# EAGLE design plugthroughckt (EAGLE 6.2)
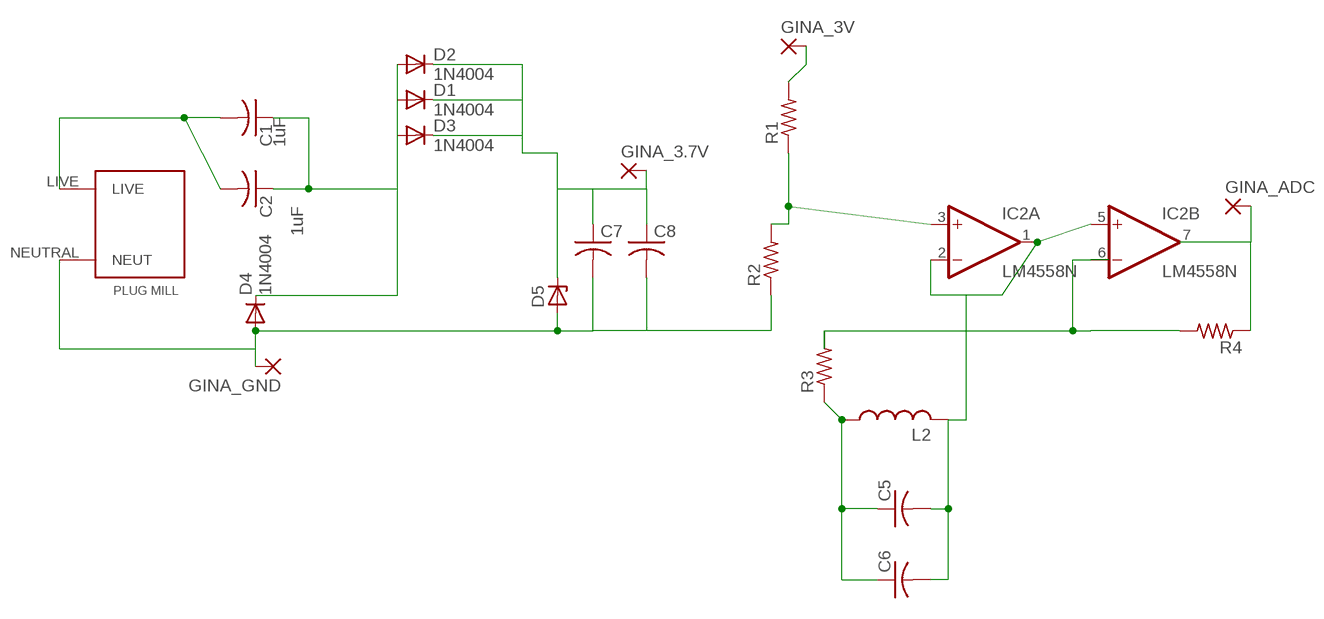
[diagram p0: schematic, sheet 1]

## Parts
C1  C-US075-032X103  [C075-032X103]
C2  C-US075-032X103  [C075-032X103]
C5  C-US075-032X103  [C075-032X103]
C6  C-US075-032X103  [C075-032X103]
C7  C-US025-050X050  [C025-050X050]
C8  C-US025-050X050  [C025-050X050]
D1  1N4004  [DO41-10]
D2  1N4004  [DO41-10]
D3  1N4004  [DO41-10]
D4  1N4004  [DO41-10]
D5  ZENER-DIODEDO41Z10  [DO41Z10]
GINA_3.7V  3,81/1,4  [3,81/1,4]
GINA_3V  3,81/1,4  [3,81/1,4]
GINA_ADC  3,81/1,4  [3,81/1,4]
GINA_GND  3,81/1,4  [3,81/1,4]
IC2  LM4558N  [DIL08]
L2  L-US0207/5V  [0207/5V]
R1  R-US_0207/10  [0207/10]
R2  R-US_0207/10  [0207/10]
R3  R-US_0207/10  [0207/10]
R4  R-US_0207/10  [0207/10]
U$1  PLUGMILL  [PLUGMILL]

## Nets
N$2: C1.2 C2.2 U$1.LIVE
N$4: IC2.3(A:+IN) R1.1 R2.2
N$5: GINA_ADC.1(P) IC2.7(B:OUT) R4.1
N$6: IC2.6(B:-IN) R3.2 R4.2
N$7: C5.1 C6.1 L2.1 R3.1
N$9: GINA_3V.1(P) R1.2
N$11: C1.1 C2.1 D1.A D2.A D3.A D4.C
N$12: C5.2 C6.2 IC2.1(A:OUT) IC2.2(A:-IN) IC2.5(B:+IN) L2.2
V+: C7.1 C8.1 D1.C D2.C D3.C D5.C GINA_3.7V.1(P)
V-: C7.2 C8.2 D4.A D5.A GINA_GND.1(P) R2.1 U$1.NEUTRAL(NEUT)

## Power pins joined to a net without a drawn wire
V+: IC2.8(P:V+)
V-: IC2.4(P:V-)

## Library data of the parts
C1 C2 = rcl:C-US: CAPACITOR, American symbol; CAPACITANCE: 1uF
C5 C6 = resistor:C-US: CAPACITOR, American symbol
C7 C8 = rcl:C-US: CAPACITOR, American symbol
D1-D4 = diode:1N4004: DIODE general purpose rectifier, 1 A
D5 = diode:ZENER-DIODE: Z-Diode
GINA_3.7V GINA_3V GINA_ADC GINA_GND = wirepad:3,81/1,4: THROUGH-HOLE PAD
IC2 = linear:*4558: OP AMP
L2 = resistor:L-US: INDUCTOR, American symbol
R1-R4 = resistor:R-US_: RESISTOR, American symbol
U$1 = plug_contact:PLUGMILL

## Board
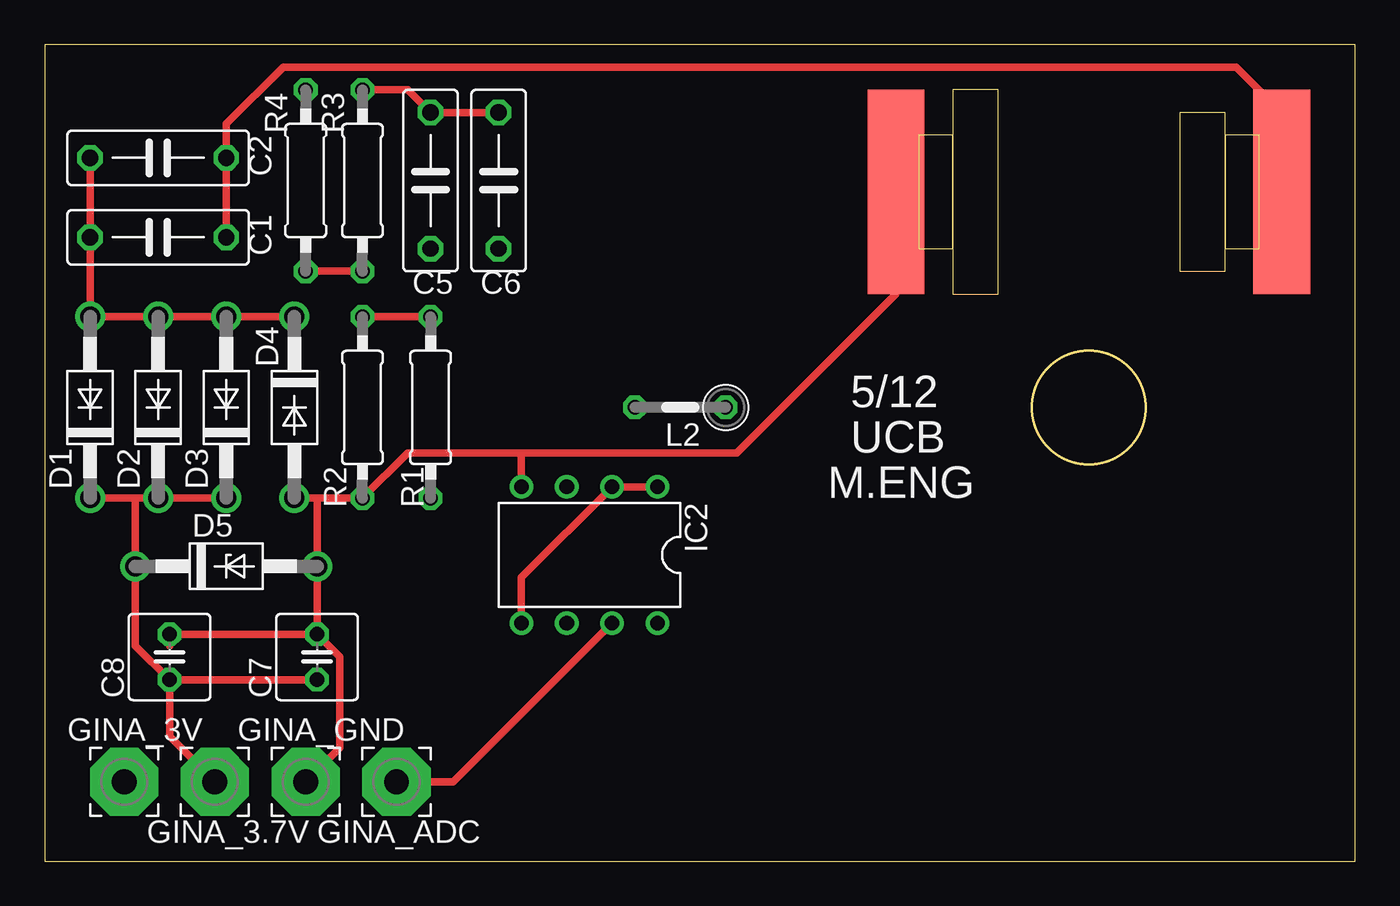
[diagram p1: board, top side]
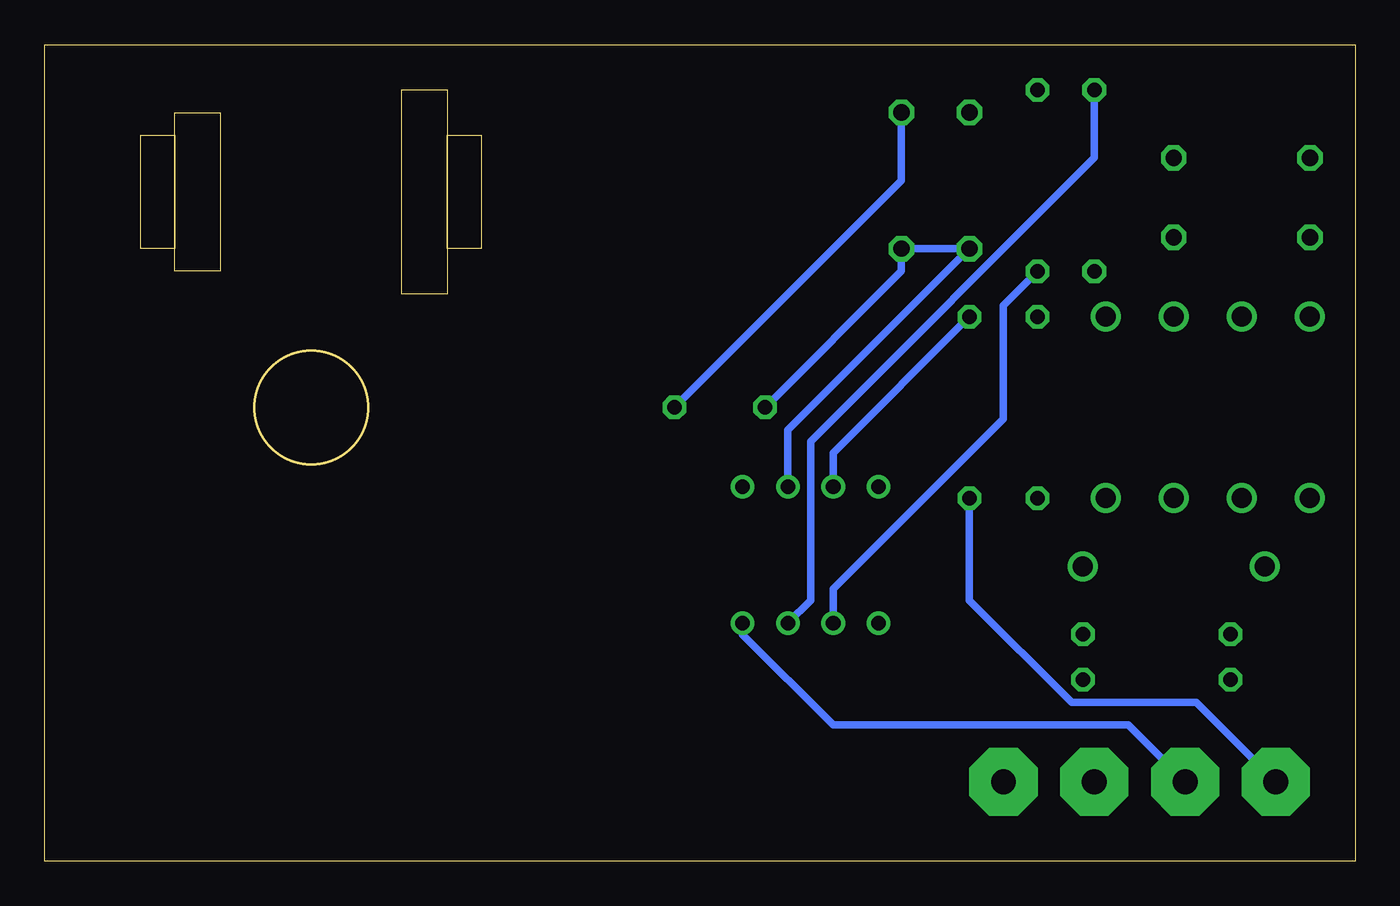
[diagram p2: board, bottom side, seen from below]

Size 73.33 x 45.71 mm. Coordinates in mm from the lower left corner, seen from the top.
Outline: 0,0 73.33,0 73.33,45.71 0,45.71 0,0
Copper layers (1*16): Top 0.035mm / dielectric 1.5mm / Bottom 0.035mm
Design rules: minimum track width 10mil, minimum drill 24mil, track to track 8mil, track to pad 8mil, pad to pad 8mil, via to via 8mil, smd to smd 8mil, copper to edge 40mil, drill to drill 8mil, minimum pad ring 10mil, minimum via ring 8mil, stop-mask expansion 4mil, vias tented up to drill 0mil, thermal gap 10mil

### Footprints (pad centres in the part's own frame; a part is rotated, then mirrored left to right if it is on the bottom)
C075-032X103 = drill 0.914 octagon: 1 -3.81,0; 2 3.81,0
C025-050X050 = drill 0.813 octagon: 1 -1.27,0; 2 1.27,0
DO41-10 = drill 1.118: A 5.08,0; C -5.08,0
DO41Z10 = drill 1.118: A 5.08,0; C -5.08,0
3,81/1,4 = drill 1.397 pad 3.81 octagon: 1 0,0
DIL08 = drill 0.813 pad 1.27: 1 -3.81,-3.81; 2 -1.27,-3.81; 3 1.27,-3.81; 4 3.81,-3.81; 5 3.81,3.81; 6 1.27,3.81; 7 -1.27,3.81; 8 -3.81,3.81
0207/5V = drill 0.813 octagon: 1 -2.54,0; 2 2.54,0
0207/10 = drill 0.813 octagon: 1 -5.08,0; 2 5.08,0
PLUGMILL = smd 3.175 x 11.43: LIVE 18.415,5.715; NEUTRAL -3.175,5.715

### Placement (x,y rotation side)
C1  6.35,34.92 0 top
C2  6.35,39.37 0 top
C5  21.59,38.1 270 top
C6  25.4,38.1 270 top
C7  15.24,11.43 90 top
C8  6.99,11.43 90 top
D1  2.54,25.4 90 top
D2  6.35,25.4 90 top
D3  10.16,25.4 90 top
D4  13.97,25.4 270 top
D5  10.16,16.51 0 top
GINA_3.7V  9.53,4.45 0 top
GINA_3V  4.45,4.45 0 top
GINA_ADC  19.68,4.45 0 top
GINA_GND  14.61,4.45 0 top
IC2  30.48,17.14 180 top
L2  35.56,25.4 180 top
R1  21.59,25.4 270 top
R2  17.78,25.4 90 top
R3  17.78,38.1 270 top
R4  14.61,38.1 270 top
U$1  50.8,31.75 0 top

### Tracks (layer width: path | path; a pad name or v marks a point on that pad's centre or on a via)
N$2
  Top 0.406: C1.2 C2.2 10.16,41.27 13.34,44.45 66.67,44.45 69.22,41.91 U$1.LIVE
N$4
  Top 0.406: R1.1 R2.2
  Bottom 0.406: R1.1 29.21,22.86 IC2.3
N$5
  Top 0.406: GINA_ADC.1 22.86,4.45 IC2.7
  Bottom 0.406: R4.1 14.61,39.37 30.48,23.5 30.48,14.61 IC2.7
N$6
  Top 0.406: R4.2 R3.2
  Bottom 0.406: R3.2 19.68,31.11 19.68,24.77 29.21,15.24 IC2.6
N$7
  Top 0.406: C6.1 C5.1 20.32,43.18 R3.1
  Bottom 0.406: L2.1 25.4,38.1 C6.1
N$9
  Bottom 0.406: GINA_3V.1 8.89,8.89 15.88,8.89 21.59,14.61 R1.2
N$11
  Top 0.406: C2.1 C1.1 D1.A D2.A D3.A D4.C
N$12
  Top 0.406: IC2.1 IC2.2 26.67,15.88 IC2.5
  Bottom 0.406: L2.2 25.4,33.02 C6.2 C5.2 31.75,24.13 IC2.2
V+
  Top 0.406: D1.C 5.08,20.32 | 5.08,20.32 D2.C D3.C | C7.1 C8.1 | 6.99,16.51 D5.C | D5.C 5.08,12.06 C8.1 | C8.1 6.99,6.99 GINA_3.7V.1 | D5.C 5.08,20.32
  Bottom 0.406: GINA_3.7V.1 12.7,7.62 29.21,7.62 34.29,12.7 IC2.8
V-
  Top 0.406: D4.A 15.24,20.32 | 15.24,20.32 R2.1 20.32,22.86 26.67,22.86 | C7.2 C8.2 6.99,12.06 | C7.2 D5.A 15.24,20.32 | GINA_GND.1 16.51,6.35 16.51,11.43 C7.2 | U$1.NEUTRAL 47.62,31.75 38.73,22.86 26.67,22.86 | IC2.4 26.67,22.86

### Text on the board
tPlace: 5/12 | UCB | M.ENG